# Altium project 定位.PrjPCB
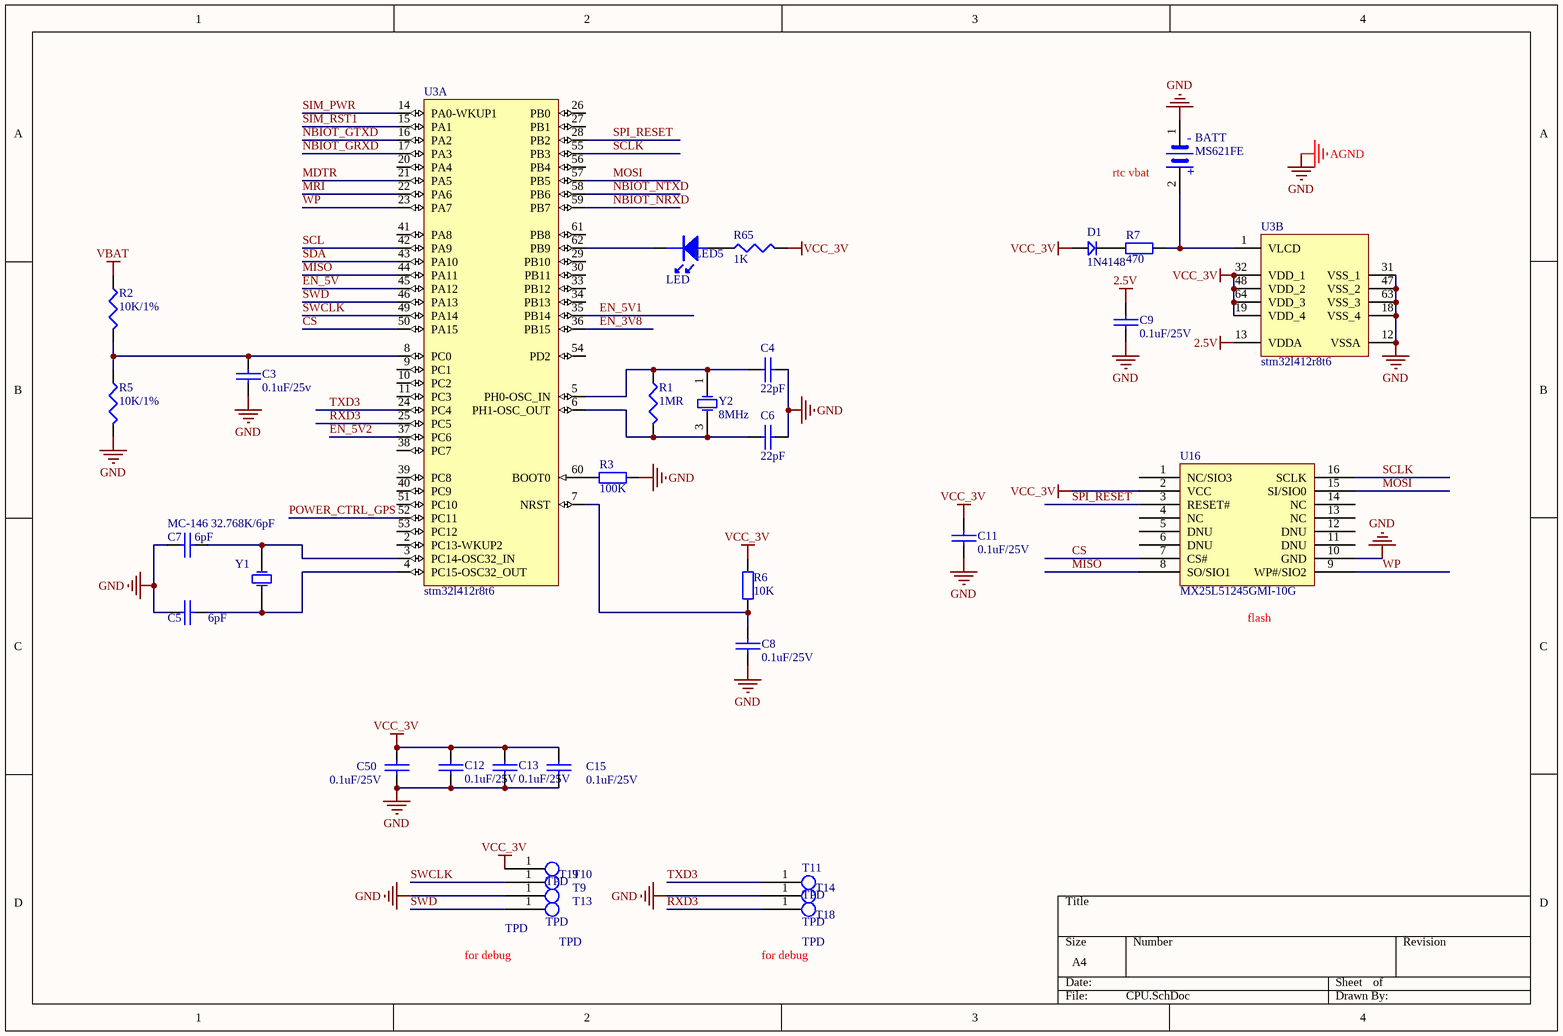
[diagram p0: CPU.SchDoc]
2 sheets, 43 parts. Net scope: global (net labels, ports and power ports of the same name join across sheets).
Board file: PCB1.2.PcbDoc
Sheets:
  CPU.SchDoc
  4G.SchDoc

## Sheet CPU.SchDoc
size A4

### Parts
BATT  MS621FE  [MS621FE]
C3  0.1uF/25v  [0402c]
C4  22pF  [0402c]
C5  6pF  [0402c]
C6  22pF  [0402c]
C7  6pF  [0402c]
C8  0.1uF/25V  [0402C]
C9  0.1uF/25V  [0402C]
C11  0.1uF/25V  [0402C]
C12  0.1uF/25V  [0402C]
C13  0.1uF/25V  [0402C]
C15  0.1uF/25V  [0402C]
C50  0.1uF/25V  [0402C]
D1  1N4148  [DIODE_SOP]
LED5  LED  [0603LED]
R1  1MR  [0402R]
R2  10K/1%  [0402R]
R3  100K  [0402R]
R5  10K/1%  [0402R]
R6  10K  [0402R]
R7  470  [0402R]
R65  1K  [0402R]
T9  TPD  [TPd]
T10  TPD  [TPd]
T11  TPD  [TPd]
T13  TPD  [TPd]
T14  TPD  [TPd]
T18  TPD  [TPd]
T19  TPD  [TPd]
U3  stm32l412r8t6  [LQFP-64]  (parts A,B of 2)
U16  MX25L51245GMI-10G  [SOP127P1030X239-16N]
Y1  MC-146 32.768K/6pF  [32.768K]
Y2  8MHz  [OSCILLATOR-3.2X2.5]

### Nets
2.5V: C9.2 U3.13(VDDA)
AGND: BATT.1 C3.2 C4.1 C5.2 C6.1 C7.2 C8.1 C9.1 C11.1 C12.1 C13.1 C15.1 C50.1 R3.2 R5.2 T13.1 T14.1 U3.12(VSSA) U3.18(VSS_4) U3.31(VSS_1) U3.47(VSS_2) U3.63(VSS_3) U16.10(GND)  [also labelled GND]
VBAT: R2.1
VCC_3V: C11.2 C12.2 C13.2 C15.2 C50.2 D1.1 R6.1 R65.2 T19.1 U3.19(VDD_4) U3.32(VDD_1) U3.48(VDD_2) U3.64(VDD_3) U16.2(VCC)
CS: U3.50(PA15) U16.7(CS#)
EN_3V8: U3.36(PB15)
EN_5V: U3.45(PA12)
EN_5V1: U3.35(PB14)
EN_5V2: U3.37(PC6)
MDTR: U3.21(PA5)
MISO: U3.44(PA11) U16.8(SO/SIO1)
MOSI: U3.57(PB5) U16.15(SI/SIO0)
MRI: U3.22(PA6)
NBIOT_GRXD: U3.17(PA3)
NBIOT_GTXD: U3.16(PA2)
NBIOT_NRXD: U3.59(PB7)
NBIOT_NTXD: U3.58(PB6)
POWER_CTRL_GPS: U3.52(PC11)
RXD3: T18.1 U3.25(PC5)
SCL: U3.42(PA9)
SCLK: U3.55(PB3) U16.16(SCLK)
SDA: U3.43(PA10)
SIM_PWR: U3.14(PA0-WKUP1)
SIM_RST1: U3.15(PA1)
SPI_RESET: U3.28(PB2) U16.3(RESET#)
SWCLK: T10.1 U3.49(PA14)
SWD: T9.1 U3.46(PA13)
TXD3: T11.1 U3.24(PC4)
WP: U3.23(PA7) U16.9(WP#/SIO2)
NetBATT_2: BATT.2 R7.2 U3.1(VLCD)
NetC3_1: C3.1 R2.2 R5.1 U3.8(PC0)
NetC4_2: C4.2 R1.1 U3.5(PH0-OSC_IN) Y2.1(OSC1)
NetC5_1: C5.1 U3.4(PC15-OSC32_OUT) Y1.2(OSC2)
NetC6_2: C6.2 R1.2 U3.6(PH1-OSC_OUT) Y2.3(OSC2)
NetC7_1: C7.1 U3.3(PC14-OSC32_IN) Y1.1(OSC1)
NetC8_2: C8.2 R6.2 U3.7(NRST)
NetD1_2: D1.2 R7.1
NetLED5_1: LED5.1 R65.1
NetLED5_2: LED5.2 U3.62(PB9)
NetR3_1: R3.1 U3.60(BOOT0)

Not connected (* = marked no-connect by the designer): U3 2(PC13-WKUP2) 9(PC1) 10(PC2) 11(PC3) 20(PA4) 26(PB0) 27(PB1) 29(PB10) 30(PB11) 33(PB12) 34(PB13) 38(PC7) 39(PC8) 40(PC9) 41(PA8) 51(PC10) 53(PC12) 54(PD2) 56(PB4) 61(PB8); U16 1(NC/SIO3) 4(NC) 5(DNU) 6(DNU) 11(DNU) 12(DNU) 13(NC) 14(NC)

### Notes on the sheet
- (near BATT) rtc vbat
- (near U16) flash
- for debug
- (in symbol SBatery) -; +

### Library data of the parts
BATT = SBatery
C3-C9 C11-C13 C15 C50 = CAP: Capacitor
D1 = D
R1 = Res3: Resistor; Published: 8-Jun-2000; LatestRevisionDate: 29-May-2009; LatestRevisionNote: IPC-7351 Footprint Added.; PackageReference: J1-0603; Publisher: Altium Limited; PackageDescription: Chip Resistor
R2 R5 R65 = RES1: P: 1/8W
R3 R6 R7 = Res2: Resistor; Value: 1K; Published: 8-Jun-2000; LatestRevisionDate: 17-Jul-2002; LatestRevisionNote: Re-released for DXP Platform.; PackageReference: AXIAL-0.4; Publisher: Altium Limited
U3 = STM32L100R8T6: ARM Cortex-M3 32-bit MCU, 64 KB Flash, 8 KB Internal RAM, 51 I/Os, 64-pin LQFP, -40 to 85 degC, Tray; Manufacturer: STMicroelectronics; D/A Converter: 2x12-bit (2 Channel); Data E2PROM nom (B): 2048; Display controller: LCD 4x32/8x28; FLASH Size (Prog) (kB): 64; I/Os (High Current): 51; Internal RAM Size (kB): 8; Operating Frequency(F) (Processor speed) (MHz): 32; Supply Voltage(Vcc) min (V): 1.8; DatasheetVersion: Rev. 1; PackageVersion: Rev. 4, 06/2013; PackageReference: LQFP64; PackageDescription: 64-Pin Low Profile Quad Flat Package, 10 x 10 mm Body, 0.5 mm Pitch; Core: ARM Cortex-M3; Packing: Tray; Mounting Technology: Surface Mount; PartNumber: STM32L100R8T6; ComponentLink1Description: Manufacturer URL; ComponentLink1URL: http://www.st.com/web/en/home.html; ComponentLink2Description: Datasheet; ComponentLink2URL: http://www.st.com/st-web-ui/static/active/en/resource/technical/document/datasheet/DM00078075.pdf; ComponentLink3Description: Package Specification; ComponentLink3URL: http://www.st.com/st-web-ui/static/active/en/resource/technical/document/datasheet/DM00037051.pdf
Y1 Y2 = XTAL: Crystal Oscillator; Published: 8-Jun-2000; LatestRevisionDate: 17-Jul-2002; LatestRevisionNote: Re-released for DXP Platform.; PackageReference: R38; Publisher: Altium Limited
  Y2: PackageDescription: Crystal, Thru-Hole; 2 Leads; Body 3.1 x 8.2 mm (Dia.xH)

## Sheet 4G.SchDoc
size A2
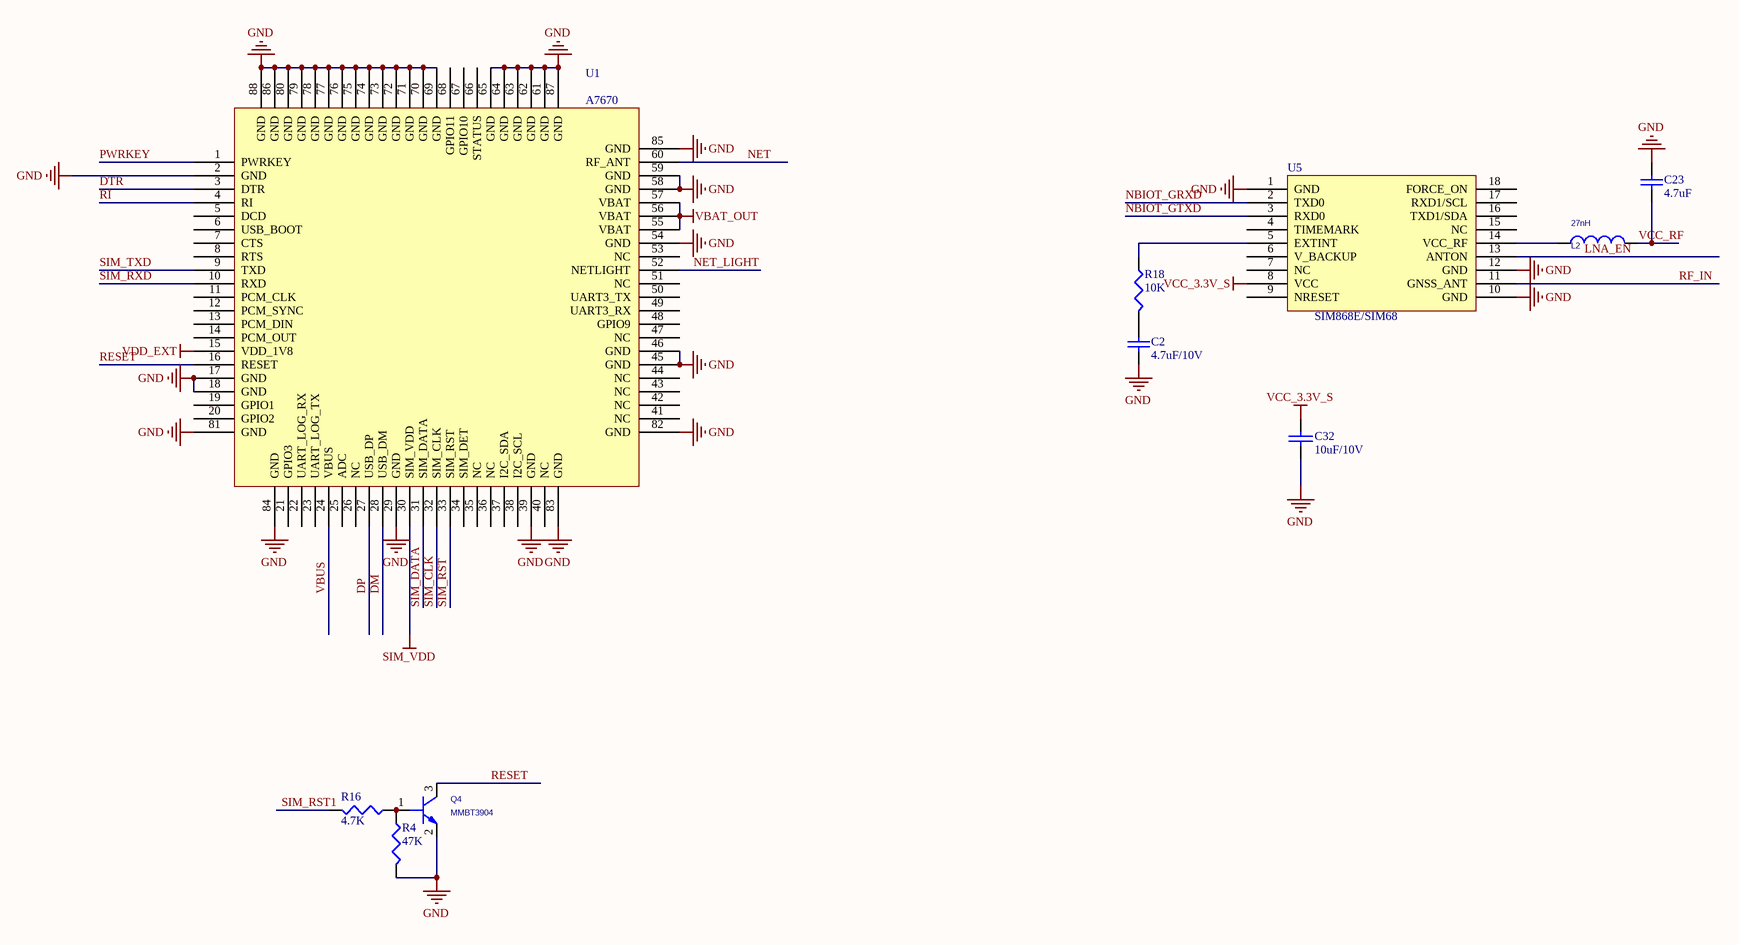
[diagram p1: 4G.SchDoc]

### Parts
C2  4.7uF/10V  [0402c]
C23  4.7uF  [0402c]
C32  10uF/10V  [0402C]
L2  27nH  [0402R]
Q4  MMBT3904  [SOT23-3]
R4  47K  [0402R]
R16  4.7K  [0402R]
R18  10K  [0402R]
U1  A7670  [A7670]
U5  SIM868E/SIM68  [SIM68MB]

### Nets
GND: C2.1 C23.1 C32.1 Q4.2(E) R4.2 U1.2(GND) U1.17(GND) U1.18(GND) U1.29(GND) U1.39(GND) U1.45(GND) U1.46(GND) U1.54(GND) U1.58(GND) U1.59(GND) U1.61(GND) U1.62(GND) U1.63(GND) U1.64(GND) U1.65(GND) U1.69(GND) U1.70(GND) U1.71(GND) U1.72(GND) U1.73(GND) U1.74(GND) U1.75(GND) U1.76(GND) U1.77(GND) U1.78(GND) U1.79(GND) U1.80(GND) U1.81(GND) U1.82(GND) U1.83(GND) U1.84(GND) U1.85(GND) U1.86(GND) U1.87(GND) U1.88(GND) U5.1(GND) U5.10(GND) U5.12(GND)  [project net AGND]
SIM_VDD: U1.30(SIM_VDD)
VBAT_OUT: U1.55(VBAT) U1.56(VBAT) U1.57(VBAT)
VCC_3.3V_S: C32.2 U5.8(VCC)
VDD_EXT: U1.15(VDD_1V8)
DM: U1.28(USB_DM)
DP: U1.27(USB_DP)
DTR: U1.3(DTR)
LNA_EN: U5.13(ANTON)
NBIOT_GRXD: U5.2(TXD0)
NBIOT_GTXD: U5.3(RXD0)
NET: U1.60(RF_ANT)
NET_LIGHT: U1.52(NETLIGHT)
PWRKEY: U1.1(PWRKEY)
RESET: Q4.3(C) U1.16(RESET)
RF_IN: U5.11(GNSS_ANT)
RI: U1.4(RI)
SIM_CLK: U1.32(SIM_CLK)
SIM_DATA: U1.31(SIM_DATA)
SIM_RST: U1.33(SIM_RST)
SIM_RST1: R16.2
SIM_RXD: U1.10(RXD)
SIM_TXD: U1.9(TXD)
VBUS: U1.24(VBUS)
VCC_RF: C23.2 L2.2
NetC2_2: C2.2 R18.2
NetL2_1: L2.1 U5.14(VCC_RF)
NetQ4_1: Q4.1(B) R4.1 R16.1
NetR18_1: R18.1 U5.5(EXTINT)

Not connected (* = marked no-connect by the designer): U1 5(DCD) 6(USB_BOOT) 7(CTS) 8(RTS) 11(PCM_CLK) 12(PCM_SYNC) 13(PCM_DIN) 14(PCM_OUT) 19(GPIO1) 20(GPIO2) 21(GPIO3) 22(UART_LOG_RX) 23(UART_LOG_TX) 25(ADC) 26(NC) 34(SIM_DET) 35(NC) 36(NC) 37(I2C_SDA) 38(I2C_SCL) 40(NC) 41(NC) 42(NC) 43(NC) 44(NC) 47(NC) 48(GPIO9) 49(UART3_RX) 50(UART3_TX) 51(NC) 53(NC) 66(STATUS) 67(GPIO10) 68(GPIO11); U5 4(TIMEMARK) 6(V_BACKUP) 7(NC) 9(NRESET) 15(NC) 16(TXD1/SDA) 17(RXD1/SCL) 18(FORCE_ON)

### Library data of the parts
C2 C23 = Cap: Capacitor; Value: 0.1uF/10V; Published: 8-Jun-2000; LatestRevisionDate: 17-Jul-2002; LatestRevisionNote: Re-released for DXP Platform.; PackageReference: RAD-0.3; Publisher: Altium Limited
C32 = CAP: Capacitor
L2 = INDUCTOR_1
Q4 = 2N1069_1: PspiceTemplate: Q^@REFDES %C %B %E
R4 R16 R18 = RES1: P: 1/8W
U5 = SIM68MB

## Nets that join several sheets
AGND: CPU (23 pins), 4G (43 pins)
NBIOT_GRXD: CPU (U3.17), 4G (U5.2)
NBIOT_GTXD: CPU (U3.16), 4G (U5.3)
SIM_RST1: CPU (U3.15), 4G (R16.2)